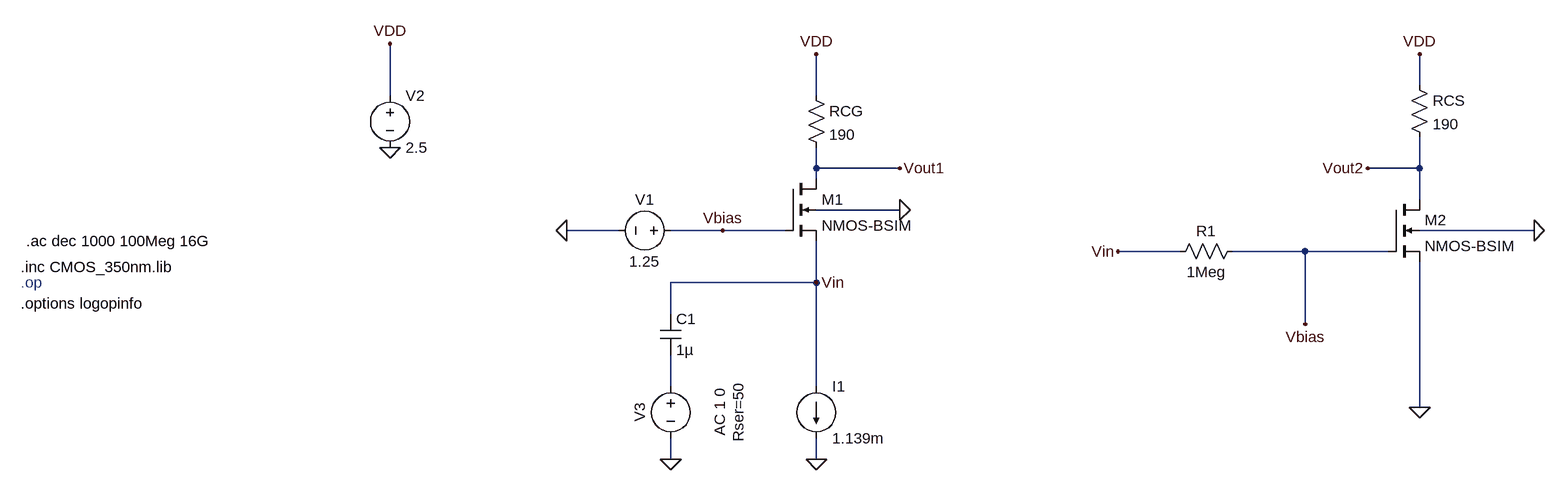
[diagram p0: schematic NMOS_350nm_CG.asc]
NMOS_350nm_CG.asc, the LTspice schematic file:
Version 4.1
SHEET 1 2660 1080
WIRE 2464 272 2464 224
WIRE 880 288 880 208
WIRE 1536 288 1536 224
WIRE 1536 400 1536 368
WIRE 1664 400 1536 400
WIRE 2464 400 2464 352
WIRE 2464 400 2384 400
WIRE 1536 416 1536 400
WIRE 2464 448 2464 400
WIRE 1664 464 1536 464
WIRE 1232 496 1152 496
WIRE 1392 496 1312 496
WIRE 1488 496 1392 496
WIRE 2640 496 2464 496
WIRE 2096 528 2000 528
WIRE 2288 528 2176 528
WIRE 2416 528 2288 528
WIRE 1536 576 1536 512
WIRE 1536 576 1312 576
WIRE 1312 624 1312 576
WIRE 2288 640 2288 528
WIRE 1312 736 1312 688
WIRE 1536 736 1536 576
WIRE 2464 768 2464 544
WIRE 1312 848 1312 816
WIRE 1536 848 1536 816
FLAG 1152 496 0
FLAG 880 368 0
FLAG 880 208 VDD
FLAG 1536 224 VDD
FLAG 1536 848 0
FLAG 1664 464 0
FLAG 1312 848 0
FLAG 1664 400 Vout1
FLAG 1536 576 Vin
FLAG 2384 400 Vout2
FLAG 2000 528 Vin
FLAG 2464 768 0
FLAG 2464 224 VDD
FLAG 2640 496 0
FLAG 1392 496 Vbias
FLAG 2288 640 Vbias
SYMBOL voltage 1328 496 R90
WINDOW 0 -32 56 VBottom 2
WINDOW 3 32 56 VTop 2
WINDOW 123 0 0 Left 0
WINDOW 39 0 0 Left 0
SYMATTR InstName V1
SYMATTR Value 1.25
SYMBOL voltage 880 272 R0
SYMATTR InstName V2
SYMATTR Value 2.5
SYMBOL res 1520 272 R0
SYMATTR InstName RCG
SYMATTR Value 190
SYMBOL voltage 1312 720 R0
WINDOW 0 -32 56 VBottom 2
WINDOW 3 32 56 VTop 2
WINDOW 123 60 56 VTop 2
WINDOW 39 88 56 VTop 2
SYMATTR InstName V3
SYMATTR Value ""
SYMATTR Value2 AC 1 0
SYMATTR SpiceLine Rser=50
SYMBOL nmos4 1488 416 R0
SYMATTR InstName M1
SYMATTR Value NMOS-BSIM
SYMATTR Value2 l=700n w=355u
SYMBOL current 1536 736 R0
WINDOW 123 0 0 Left 0
WINDOW 39 0 0 Left 0
SYMATTR InstName I1
SYMATTR Value 1.139m
SYMBOL cap 1296 624 R0
SYMATTR InstName C1
SYMATTR Value 1µ
SYMBOL nmos4 2416 448 R0
SYMATTR InstName M2
SYMATTR Value NMOS-BSIM
SYMATTR Value2 l=700n w=355u
SYMBOL res 2448 256 R0
SYMATTR InstName RCS
SYMATTR Value 190
SYMBOL res 2192 512 R90
WINDOW 0 0 56 VBottom 2
WINDOW 3 32 56 VTop 2
SYMATTR InstName R1
SYMATTR Value 1Meg
TEXT 312 576 Left 2 ;.op
TEXT 312 608 Left 2 !.options logopinfo
TEXT 312 552 Left 2 !.inc CMOS_350nm.lib
TEXT 320 512 Left 2 !.ac dec 1000 100Meg 16G

The netlist it stands for:
* NMOS_350nm_CG.asc
V1 Vbias 0 1.25
V2 VDD 0 2.5
RCG VDD Vout1 190
V3 N001 0 AC 1 0 Rser=50
M1 Vout1 Vbias Vin 0 NMOS-BSIM l=700n w=355u
I1 Vin 0 1.139m
C1 Vin N001 1µ
M2 Vout2 Vbias 0 0 NMOS-BSIM l=700n w=355u
RCS VDD Vout2 190
R1 Vbias Vin 1Meg
.model NMOS NMOS
.model PMOS PMOS
.lib standard.mos
* .op
.options logopinfo
.inc CMOS_350nm.lib
.ac dec 1000 100Meg 16G
.backanno
.end